# Altium project ina_extension_jack_motor.PrjPcb
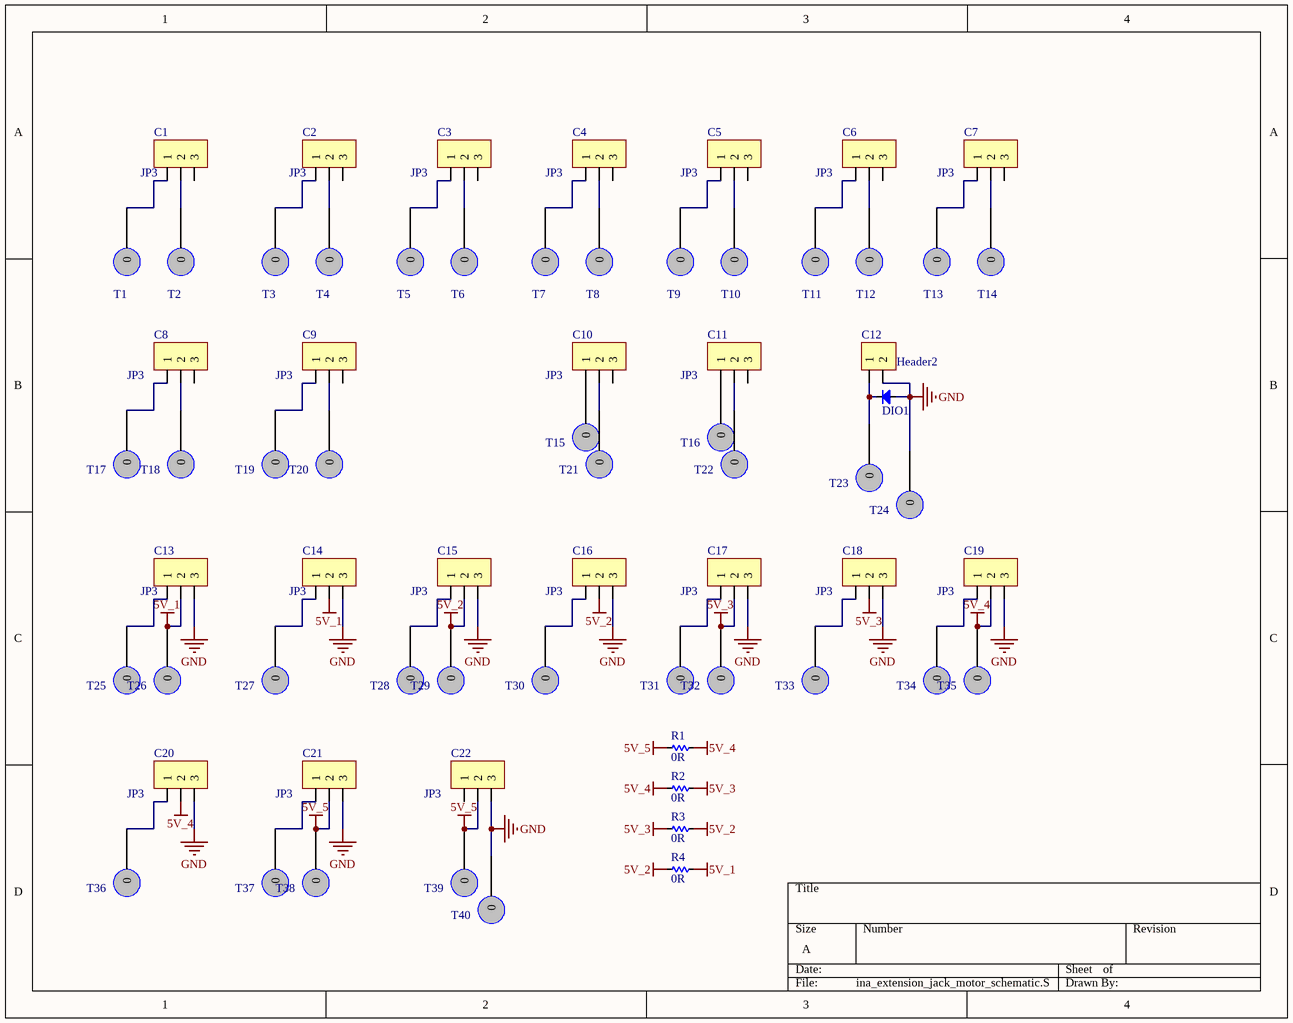
[diagram p0: ina_extension_jack_motor_schematic.SchDoc]
1 sheet, 67 parts. Net scope: global (net labels, ports and power ports of the same name join across sheets).
Board file: ina_extension_jack_motor_pcb.PcbDoc

## Sheet ina_extension_jack_motor_schematic.SchDoc
size A

### Parts
C1  JP3  [JP3-D1T]
C2  JP3  [JP3-D1T]
C3  JP3  [JP3-D1T]
C4  JP3  [JP3-D1T]
C5  JP3  [JP3-D1T]
C6  JP3  [JP3-D1T]
C7  JP3  [JP3-D1T]
C8  JP3  [JP3-D1T]
C9  JP3  [JP3-D1T]
C10  JP3  [JP3-D1T]
C11  JP3  [JP3-D1T]
C12  Header2  [Header2]
C13  JP3  [JP3-D1T]
C14  JP3  [JP3-D1T]
C15  JP3  [JP3-D1T]
C16  JP3  [JP3-D1T]
C17  JP3  [JP3-D1T]
C18  JP3  [JP3-D1T]
C19  JP3  [JP3-D1T]
C20  JP3  [JP3-D1T]
C21  JP3  [JP3-D1T]
C22  JP3  [JP3-D1T]
DIO1  Diode SMD  [DIO-SMD-123]  (value not drawn)
R1  0R  [RES-SMD-0603]
R2  0R  [RES-SMD-0603]
R3  0R  [RES-SMD-0603]
R4  0R  [RES-SMD-0603]
T1  Pad  [PCBComponent_1]  (value not drawn)
T2  Pad  [PCBComponent_1]  (value not drawn)
T3  Pad  [PCBComponent_1]  (value not drawn)
T4  Pad  [PCBComponent_1]  (value not drawn)
T5  Pad  [PCBComponent_1]  (value not drawn)
T6  Pad  [PCBComponent_1]  (value not drawn)
T7  Pad  [PCBComponent_1]  (value not drawn)
T8  Pad  [PCBComponent_1]  (value not drawn)
T9  Pad  [PCBComponent_1]  (value not drawn)
T10  Pad  [PCBComponent_1]  (value not drawn)
T11  Pad  [PCBComponent_1]  (value not drawn)
T12  Pad  [PCBComponent_1]  (value not drawn)
T13  Pad  [PCBComponent_1]  (value not drawn)
T14  Pad  [PCBComponent_1]  (value not drawn)
T15  Pad  [PCBComponent_1]  (value not drawn)
T16  Pad  [PCBComponent_1]  (value not drawn)
T17  Pad  [PCBComponent_1]  (value not drawn)
T18  Pad  [PCBComponent_1]  (value not drawn)
T19  Pad  [PCBComponent_1]  (value not drawn)
T20  Pad  [PCBComponent_1]  (value not drawn)
T21  Pad  [PCBComponent_1]  (value not drawn)
T22  Pad  [PCBComponent_1]  (value not drawn)
T23  Pad  [PCBComponent_1]  (value not drawn)
T24  Pad  [PCBComponent_1]  (value not drawn)
T25  Pad  [PCBComponent_1]  (value not drawn)
T26  Pad  [PCBComponent_1]  (value not drawn)
T27  Pad  [PCBComponent_1]  (value not drawn)
T28  Pad  [PCBComponent_1]  (value not drawn)
T29  Pad  [PCBComponent_1]  (value not drawn)
T30  Pad  [PCBComponent_1]  (value not drawn)
T31  Pad  [PCBComponent_1]  (value not drawn)
T32  Pad  [PCBComponent_1]  (value not drawn)
T33  Pad  [PCBComponent_1]  (value not drawn)
T34  Pad  [PCBComponent_1]  (value not drawn)
T35  Pad  [PCBComponent_1]  (value not drawn)
T36  Pad  [PCBComponent_1]  (value not drawn)
T37  Pad  [PCBComponent_1]  (value not drawn)
T38  Pad  [PCBComponent_1]  (value not drawn)
T39  Pad  [PCBComponent_1]  (value not drawn)
T40  Pad  [PCBComponent_1]  (value not drawn)

### Nets
5V_1: C13.2 C14.2 R4.2 T26.0
5V_2: C15.2 C16.2 R3.2 R4.1 T29.0
5V_3: C17.2 C18.2 R2.2 R3.1 T32.0
5V_4: C19.2 C20.2 R1.2 R2.1 T35.0
5V_5: C21.2 C22.2 R1.1 T38.0 T39.0
GND: C12.2 C13.3 C14.3 C15.3 C16.3 C17.3 C18.3 C19.3 C20.3 C21.3 C22.3 DIO1.1(A) T24.0 T40.0
NetC1_1: C1.1 T1.0
NetC1_2: C1.2 T2.0
NetC2_1: C2.1 T3.0
NetC2_2: C2.2 T4.0
NetC3_1: C3.1 T5.0
NetC3_2: C3.2 T6.0
NetC4_1: C4.1 T7.0
NetC4_2: C4.2 T8.0
NetC5_1: C5.1 T9.0
NetC5_2: C5.2 T10.0
NetC6_1: C6.1 T11.0
NetC6_2: C6.2 T12.0
NetC7_1: C7.1 T13.0
NetC7_2: C7.2 T14.0
NetC8_1: C8.1 T17.0
NetC8_2: C8.2 T18.0
NetC9_1: C9.1 T19.0
NetC9_2: C9.2 T20.0
NetC10_1: C10.1 T15.0
NetC10_2: C10.2 T21.0
NetC11_1: C11.1 T16.0
NetC11_2: C11.2 T22.0
NetC12_1: C12.1 DIO1.2(K) T23.0
NetC13_1: C13.1 T25.0
NetC14_1: C14.1 T27.0
NetC15_1: C15.1 T28.0
NetC16_1: C16.1 T30.0
NetC17_1: C17.1 T31.0
NetC18_1: C18.1 T33.0
NetC19_1: C19.1 T34.0
NetC20_1: C20.1 T36.0
NetC21_1: C21.1 T37.0

Not connected (* = marked no-connect by the designer): C1 3; C2 3; C3 3; C4 3; C5 3; C6 3; C7 3; C8 3; C9 3; C10 3; C11 3; C22 1

### Library data of the parts
C1-C11 C13-C22 = JP3: WR-PHD 2.54 mm Angled Socket Header; Manufacturer: W¨¹rth Elektronik eiSos GmbH; partNo: 613003143121; ComponentLink1 Description: Manufacturer; ComponentLink2 Description: Datasheet; NoPins: 03; Created Date: 29 March 2013; ComponentLink1URL: http://www.we-online.com; ComponentLink2URL: http://katalog.we-online.de/em/datasheet/6130xx143121.pdf; Created by: Karrer Zheng
C12 = Header2: Header IDC, 2 x 1 Pin Vertical 2.54mm Pitch (Non-Boxed, Male); Manufacturer: W¨¹rth Elektronik eiSos GmbH; partNo: 613002143121; ComponentLink1 Description: Manufacturer; ComponentLink2 Description: Datasheet; NoPins: 02; Created Date: 29 March 2013; ComponentLink1URL: http://www.we-online.com; ComponentLink2URL: http://katalog.we-online.de/em/datasheet/6130xx143121.pdf; Created by: Karrer Zheng
DIO1 = Diode SMD: Default Diode; Code - JEDEC: DO-214-AB; Value: 1N5007; Published: 8-Jun-2000; Revision: July-2002: Re-released for DXP Platform.; Publisher: Altium Limited
R1-R4 = Res-SMD: Resistor; Manufacturer: Generic Components; Class: Passive; Published: 08/06/2000; Publisher: Altium Hobart Technology Centre
T1-T40 = Component_1